# EAGLE design W5500_Tessera_mikroBUS_Click_003 (EAGLE 6.5.0)
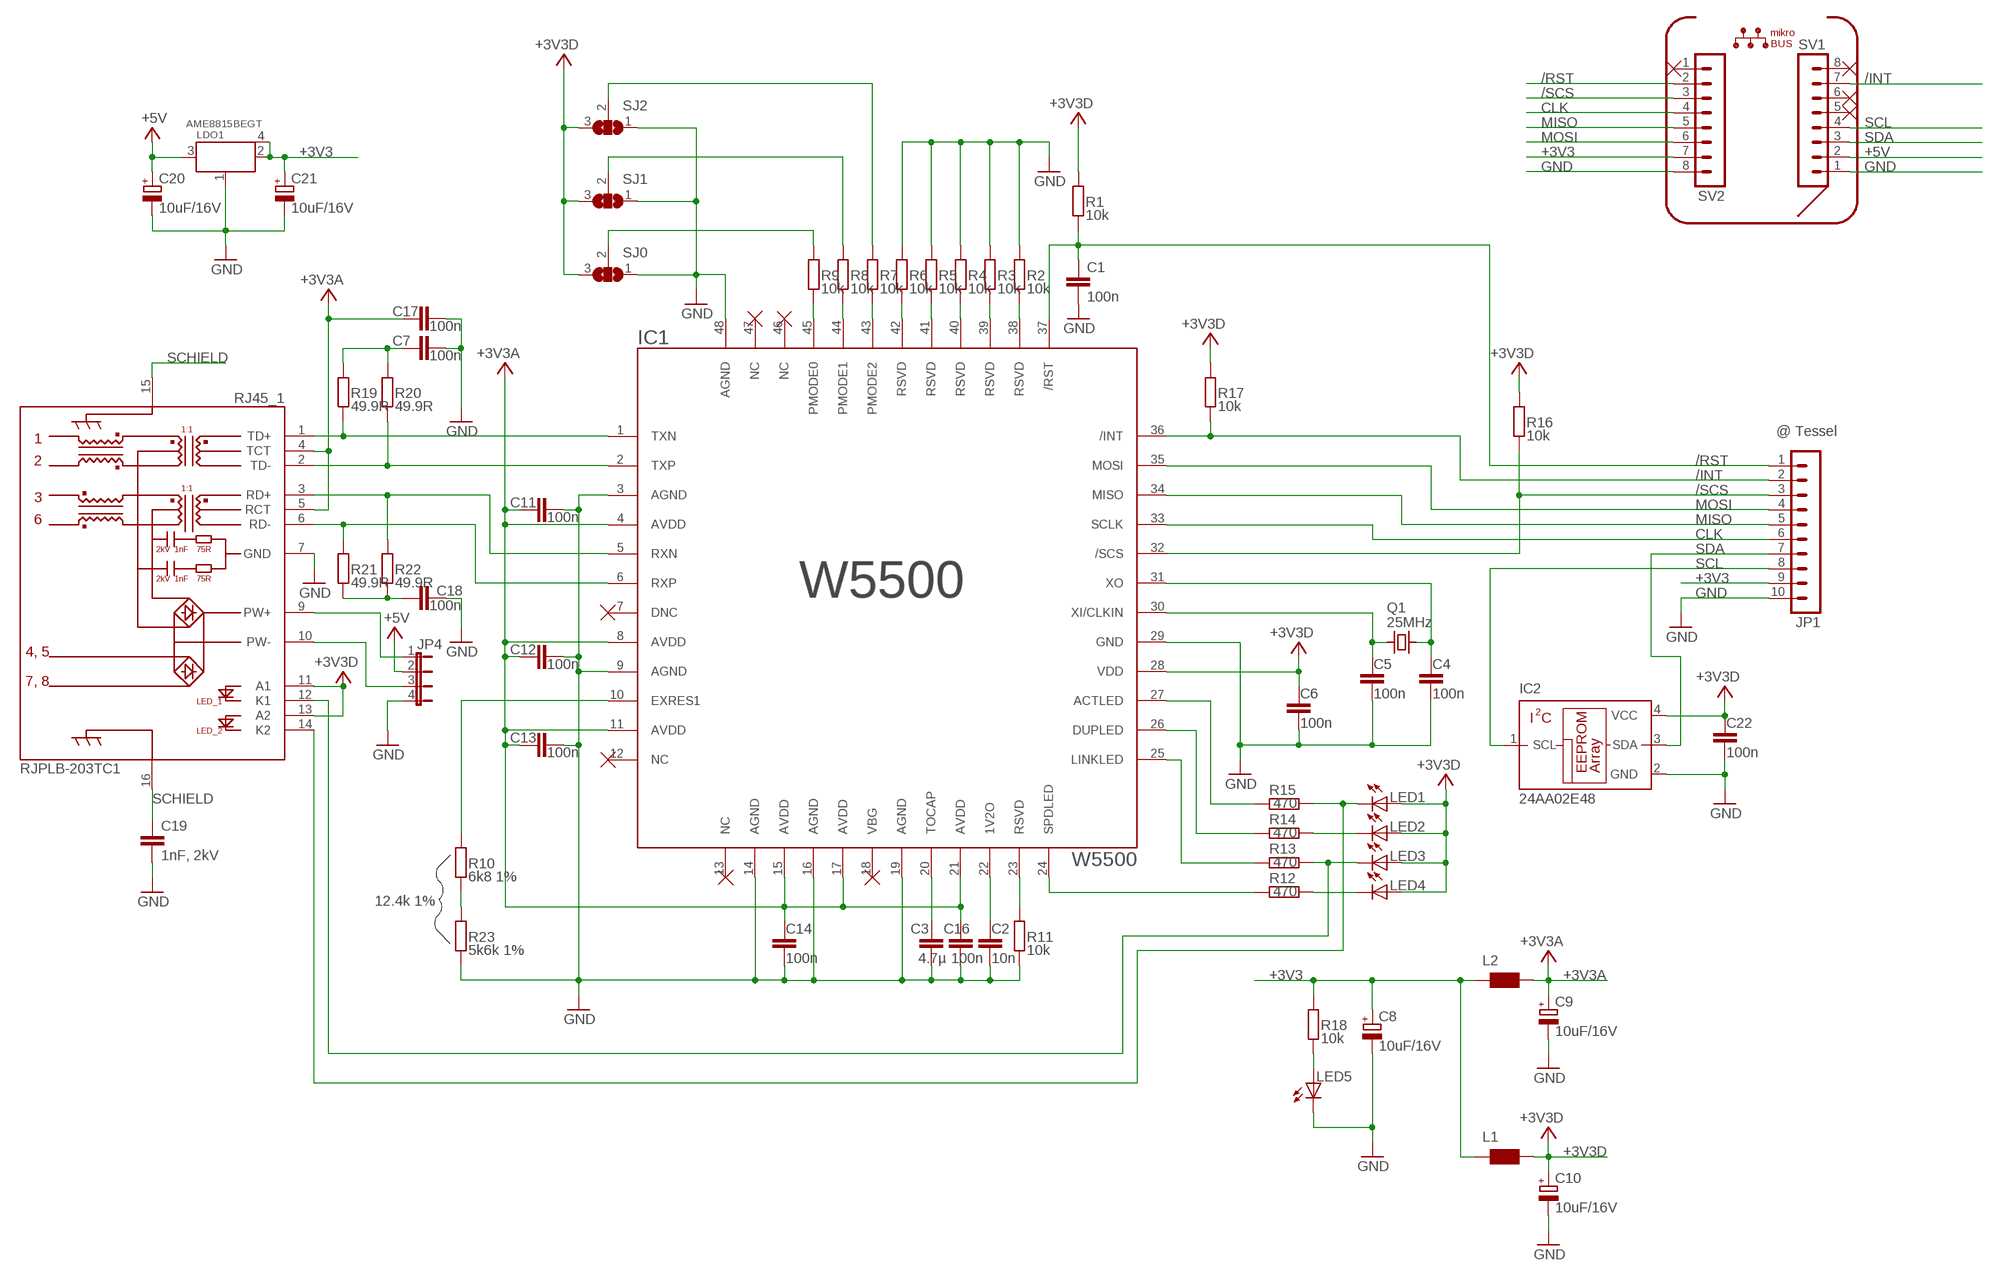
[diagram p0: schematic, sheet 1]

## Parts
C1  100n  C-EUC0603K  [C0603K]
C2  10n  C-EUC0402K  [C0402K]
C3  4.7µ  C-EUC2012  [C2012]
C4  100n  C-EUC0402K  [C0402K]
C5  100n  C-EUC0402K  [C0402K]
C6  100n  C-EUC0402K  [C0402K]
C7  100n  C-EUC0402K  [C0402K]
C8  10uF/16V  CPOL-EUA/3216-18W  [A/3216-18W]
C9  10uF/16V  CPOL-EUA/3216-18W  [A/3216-18W]
C10  10uF/16V  CPOL-EUA/3216-18W  [A/3216-18W]
C11  100n  C-EUC0402K  [C0402K]
C12  100n  C-EUC0402K  [C0402K]
C13  100n  C-EUC0402K  [C0402K]
C14  100n  C-EUC0402K  [C0402K]
C16  100n  C-EUC0402K  [C0402K]
C17  100n  C-EUC0402K  [C0402K]
C18  100n  C-EUC0402K  [C0402K]
C19  1nF, 2kV  C-EUC3216  [C3216]
C20  10uF/16V  CPOL-EUA/3216-18W  [A/3216-18W]
C21  10uF/16V  CPOL-EUA/3216-18W  [A/3216-18W]
C22  100n  C-EUC0402K  [C0402K]
IC1  W5500  [LQFP48]
IC2  24AA02E48  24AA00OT  [SOT23-5L]
JP1  @ Tessel  MA10-1  [MA10-1]
JP4  JP4E  [JP4]
L1  WE-CBF_0603  [0603]
L2  WE-CBF_0603  [0603]
LDO1  AME8815BEGT  [SOT223]
LED1  LEDCHIPLED_0603  [CHIPLED_0603]
LED2  LEDCHIPLED_0603  [CHIPLED_0603]
LED3  LEDCHIPLED_0603  [CHIPLED_0603]
LED4  LEDCHIPLED_0603  [CHIPLED_0603]
LED5  LEDCHIPLED_0603  [CHIPLED_0603]
Q1  25MHz  SMD02502-4  [SMD02502-4]
R1  10k  R-EU_R0402  [R0402]
R2  10k  R-EU_R0402  [R0402]
R3  10k  R-EU_R0402  [R0402]
R4  10k  R-EU_R0402  [R0402]
R5  10k  R-EU_R0402  [R0402]
R6  10k  R-EU_R0402  [R0402]
R7  10k  R-EU_R0402  [R0402]
R8  10k  R-EU_R0402  [R0402]
R9  10k  R-EU_R0402  [R0402]
R10  6k8 1%  R-EU_R0402  [R0402]
R11  10k  R-EU_R0402  [R0402]
R12  470  R-EU_R0402  [R0402]
R13  470  R-EU_R0402  [R0402]
R14  470  R-EU_R0402  [R0402]
R15  470  R-EU_R0402  [R0402]
R16  10k  R-EU_R0402  [R0402]
R17  10k  R-EU_R0402  [R0402]
R18  10k  R-EU_R0402  [R0402]
R19  49.9R  R-EU_R0402  [R0402]
R20  49.9R  R-EU_R0402  [R0402]
R21  49.9R  R-EU_R0402  [R0402]
R22  49.9R  R-EU_R0402  [R0402]
R23  5k6k 1%  R-EU_R0402  [R0402]
RJ45_1  RJPLB-203TC1  [RJPLB-203]
SJ0  SJ2W  [SJ_2]
SJ1  SJ2W  [SJ_2]
SJ2  SJ2W  [SJ_2]
SV1  MA08-1  [MA08-1]
SV2  MA08-1  [MA08-1]

## Nets
+3V3: C8.+ C21.+ JP1.9 JP4.2 L1.2 L2.2 LDO1.2 LDO1.4 R18.2 SV2.7 ; supply symbol labelled +5V
+3V3A: C9.+ C11.1 C12.1 C13.1 C14.1 C16.1 C17.1 IC1.4(AVDD) IC1.8(AVDD) IC1.11(AVDD) IC1.15(AVDD) IC1.17(AVDD) IC1.21(AVDD) L2.1 RJ45_1.4(TCT) RJ45_1.5(RCT)
+3V3D: C6.1 C10.+ C22.1 IC1.28(VDD) IC2.4(VCC) L1.1 LED1.A LED2.A LED3.A LED4.A R1.2 R16.2 R17.2 RJ45_1.11(A1) RJ45_1.13(A2) SJ0.3 SJ1.3 SJ2.3
+5V: C20.+ LDO1.3 SV1.2
/INT: IC1.36(/INT) JP1.2 R17.1 SV1.7
/RST: C1.1 IC1.37(/RST) JP1.1 R1.1 SV2.2
/SCS: IC1.32(/SCS) JP1.3 R16.1 SV2.3
ACTLED: IC1.27(ACTLED) R15.1
CLK: IC1.33(SCLK) JP1.6 SV2.4
GND: C1.2 C2.2 C3.2 C4.2 C5.2 C6.2 C7.2 C8.- C9.- C10.- C11.2 C12.2 C13.2 C14.2 C16.2 C17.2 C18.2 C19.2 C20.- C21.- C22.2 IC1.3(AGND) IC1.9(AGND) IC1.14(AGND) IC1.16(AGND) IC1.19(AGND) IC1.29(GND) IC1.48(AGND) IC2.2(GND) JP1.10 JP4.4 LDO1.1 LED5.C R2.2 R3.2 R4.2 R5.2 R6.2 R11.1 R23.1 RJ45_1.7(GND) SJ0.1 SJ1.1 SJ2.1 SV1.1 SV2.8
MISO: IC1.34(MISO) JP1.5 SV2.5
MOSI: IC1.35(MOSI) JP1.4 SV2.6
N$4: IC1.25(LINKLED) R13.1
N$5: R10.1 R23.2
N$9: IC1.23(RSVD) R11.2
N$10: IC1.38(RSVD) R2.1
N$11: IC1.39(RSVD) R3.1
N$12: IC1.40(RSVD) R4.1
N$13: IC1.41(RSVD) R5.1
N$14: IC1.42(RSVD) R6.1
N$15: IC1.43(PMODE2) R7.1
N$16: IC1.44(PMODE1) R8.1
N$17: IC1.45(PMODE0) R9.1
N$18: R9.2 SJ0.2
N$19: R8.2 SJ1.2
N$20: R7.2 SJ2.2
N$22: IC1.10(EXRES1) R10.2
N$23: C2.1 IC1.22(1V2O)
N$24: C3.1 IC1.20(TOCAP)
N$25: IC1.24(SPDLED) R12.1
N$26: IC1.26(DUPLED) R14.1
N$28: LED4.C R12.2
N$29: LED3.C R13.2 RJ45_1.12(K1)
N$30: LED2.C R14.2
N$31: LED1.C R15.2 RJ45_1.14(K2)
N$32: C4.1 IC1.31(XO) Q1.3
N$33: C5.1 IC1.30(XI/CLKIN) Q1.1
N$34: LED5.A R18.1
N$35: C7.1 R19.2 R20.2
N$36: C18.1 R21.1 R22.1
POE+: JP4.1 RJ45_1.9(PW+)
POE-: JP4.3 RJ45_1.10(PW-)
RXN: IC1.6(RXP) R21.2 RJ45_1.6(RD-)
RXP: IC1.5(RXN) R22.2 RJ45_1.3(RD+)
SCHIELD: C19.1 RJ45_1.15(SCHIELD_1) RJ45_1.16(SCHIELD_2)
SCL: IC2.1(SCL) JP1.8 SV1.4
SDA: IC2.3(SDA) JP1.7 SV1.3
TXN: IC1.2(TXP) R20.1 RJ45_1.2(TD-)
TXP: IC1.1(TXN) R19.1 RJ45_1.1(TD+)
Unconnected: IC1.7(DNC) IC1.12(NC) IC1.13(NC) IC1.18(VBG) IC1.46(NC) IC1.47(NC) SV1.5 SV1.6 SV1.8 SV2.1

## Notes on the sheet
- mikro
  BUS
- W5500
- 12.4k 1%

## Library data of the parts
C1-C7 C11-C14 C16-C19 C22 = resistor:C-EU: CAPACITOR, European symbol
C8-C10 C20 C21 = resistor:CPOL-EU: POLARIZED CAPACITOR, European symbol
IC1 = _wiznet_2013-08-18:W5500: W5500: WIZnet Hardwired TCP/IP + MAC + PHY - Internet Interface Chip
IC2 = microchip:24*00: Serial EEPROM 128 bit, I2C (AA = 1.8 V/LC = 2.5 V/C = 5.0 V); MF: MICROCHIP; MPN: 24AA00T-I/OTG; OC_FARNELL: 1331264; OC_NEWARK: 89H3038
JP1 = con-lstb:MA10-1: PIN HEADER; OC_FARNELL: unknown; OC_NEWARK: unknown
JP4 = jumper:JP4E: JUMPER
L1 L2 = wuerth-elektronik:WE-CBF: SMD EMI Suppression Ferrite Beads - excellent anti-EMI properties - low DCR - impedances till 3000 ohms - rated current up to 6 A
LDO1 = _wiznet_2013-08-18:AME8815BEGT
LED1-LED5 = led:LED: LED OSRAM: - CHIPLED LG R971, LG N971, LY N971, LG Q971, LY Q971, LO R971, LY R971 LH N974, LH R974 LS Q976, LO Q976, LY Q976 LO Q996 - Hyper CHIPLED LW Q18S LB Q993, LB Q99A, LB R99A - SideLED LS A670, LO A670, LY A670, LG A670, LP A670 LB A673, LV A673, LT A673, LW A673 LH A674 LY A675 LS A676, LA A676, LO A676, LY A676, LW A676 LS A679, LY A679, LG A679 - Hyper Micro SIDELED® LS Y876, LA Y876, LO Y876, LY Y876 LT Y87S - SmartLED LW L88C, LW L88S LB L89C, LB L89S, LG L890 LS L89K, LO L89K, LY L89K LS L896, LA L896, LO L896, LY L896 - TOPLED LS T670, LO T670, LY T670, LG T670, LP T670 LSG T670, LSP T670, LSY T670, LOP T670, LYG T670 LG T671, LOG T671, LSG T671 LB T673, LV T673, LT T673, LW T673 LH T674 LS T676, LA T676, LO T676, LY T676, LB T676, LH T676, LSB T676, LW T676 LB T67C, LV T67C, LT T67C, LS T67K, LO T67K, LY T67K, LW E67C LS E67B, LA E67B, LO E67B, LY E67B, LB E67C, LV E67C, LT E67C LW T67C LS T679, LY T679, LG T679 LS T770, LO T770, LY T770, LG T770, LP T770 LB T773, LV T773, LT T773, LW T773 LH T774 LS E675, LA E675, LY E675, LS T675 LS T776, LA T776, LO T776, LY T776, LB T776 LHGB T686 LT T68C, LB T68C - Hyper Mini TOPLED® LB M676 - Mini TOPLED Santana® LG M470 LS M47K, LO M47K, LY M47K Source: http://www.osram.convergy.de LUXEON: - LUMILED® LXK2-PW12-R00, LXK2-PW12-S00, LXK2-PW14-U00, LXK2-PW14-V00 LXK2-PM12-R00, LXK2-PM12-S00, LXK2-PM14-U00 LXK2-PE12-Q00, LXK2-PE12-R00, LXK2-PE12-S00, LXK2-PE14-T00, LXK2-PE14-U00 LXK2-PB12-K00, LXK2-PB12-L00, LXK2-PB12-M00, LXK2-PB14-N00, LXK2-PB14-P00, LXK2-PB14-Q00 LXK2-PR12-L00, LXK2-PR12-M00, LXK2-PR14-Q00, LXK2-PR14-R00 LXK2-PD12-Q00, LXK2-PD12-R00, LXK2-PD12-S00 LXK2-PH12-R00, LXK2-PH12-S00 LXK2-PL12-P00, LXK2-PL12-Q00, LXK2-PL12-R00 Source: www.luxeon.com KINGBRIGHT: KA-3528ASYC Source: www.kingbright.com
Q1 = Petermann_5_11_0:SMD02502-4
R1-R23 = resistor:R-EU_: RESISTOR, European symbol
RJ45_1 = Taimag:RJPLB-203TC1
SJ0 SJ1 SJ2 = jumper:SJ2W: SMD solder JUMPER
SV1 SV2 = con-lstb:MA08-1: PIN HEADER; OC_FARNELL: unknown; OC_NEWARK: unknown

## Board
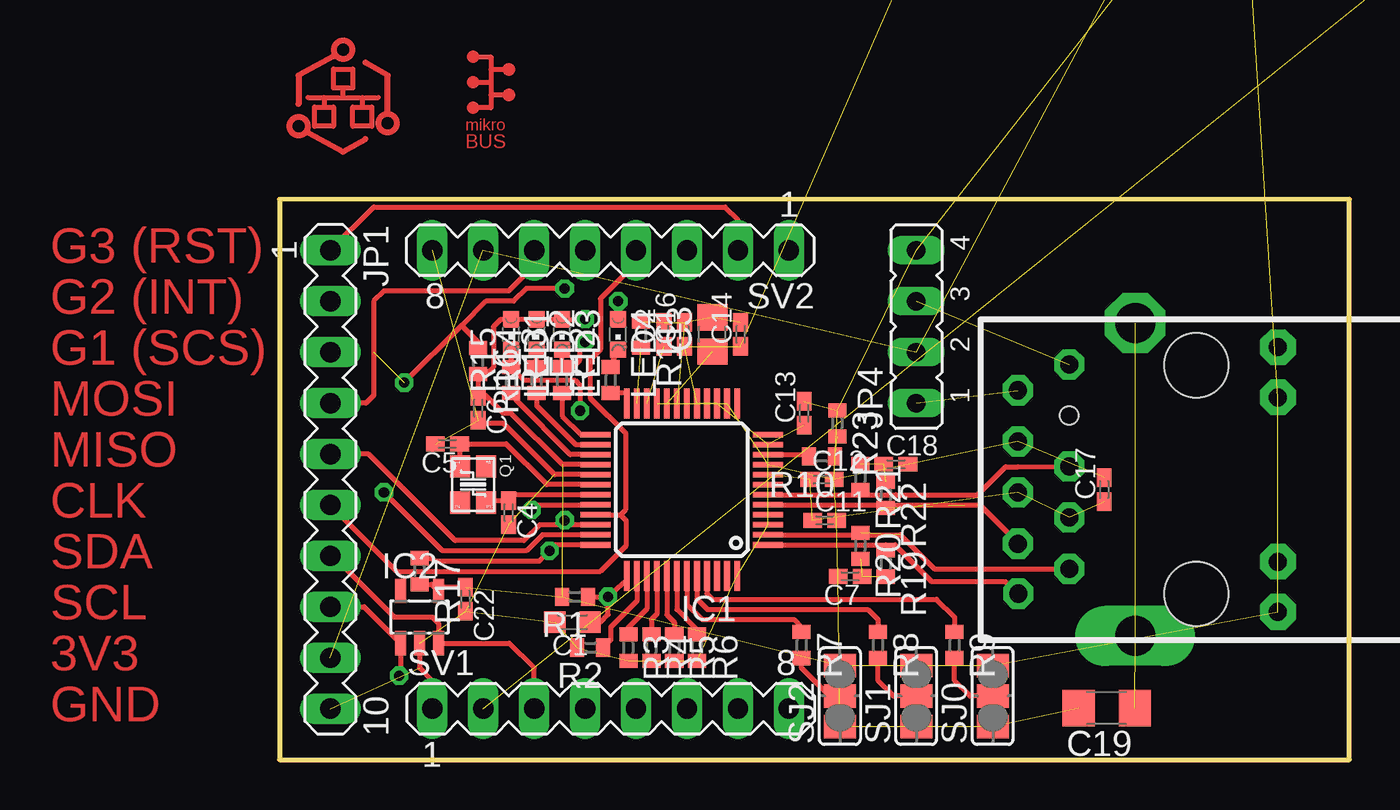
[diagram p1: board, top side]
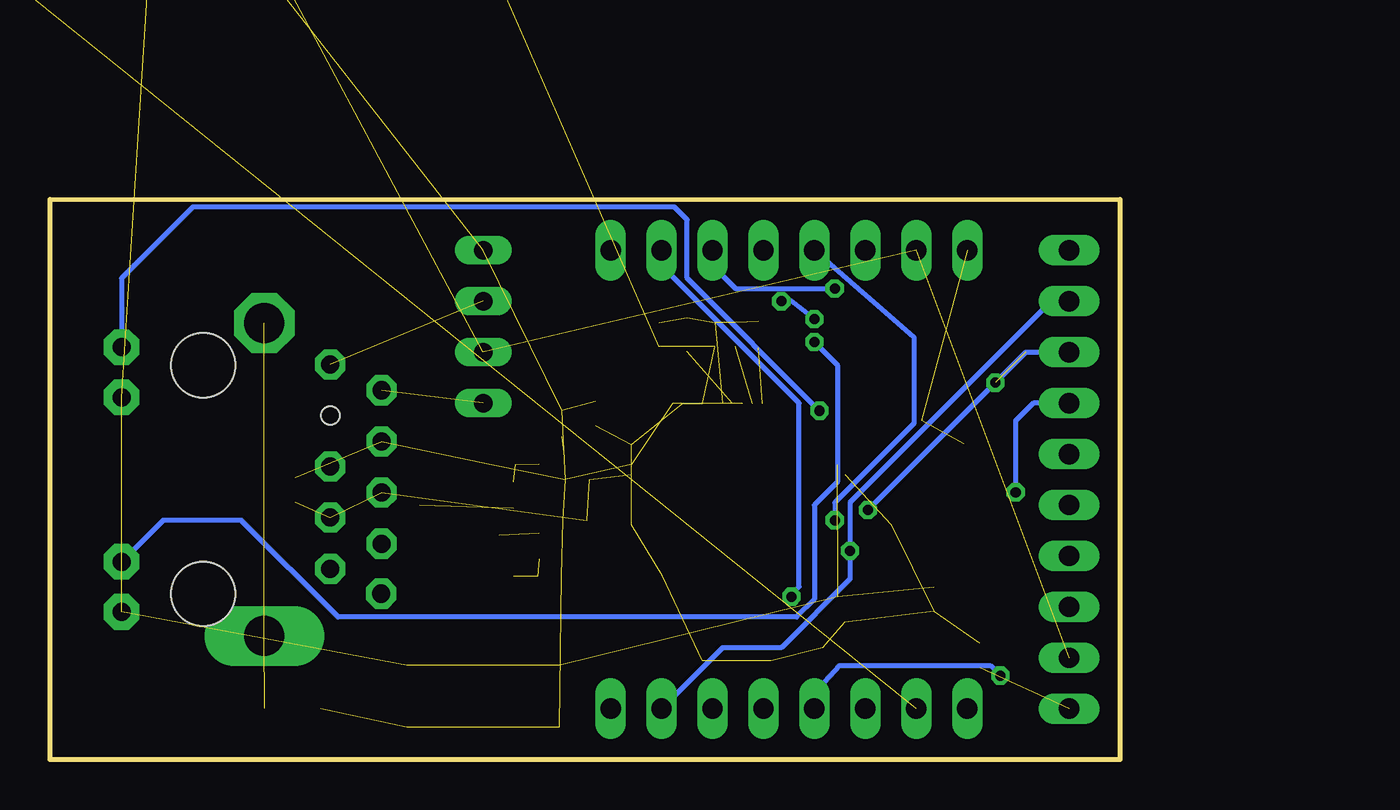
[diagram p2: board, bottom side, seen from below]

Size 53.34 x 27.94 mm. Coordinates in mm from the lower left corner, seen from the top.
Outline: 0,0 53.34,0 53.34,27.94 0,27.93 0,0
Copper layers (1*16): Top 0.035mm / dielectric 1.5mm / Bottom 0.035mm
Design rules "default": minimum track width 10mil, minimum drill 24mil, track to track 8mil, track to pad 8mil, pad to pad 8mil, via to via 8mil, smd to smd 8mil, copper to edge 40mil, drill to drill 8mil, minimum pad ring 10mil, minimum via ring 8mil, stop-mask expansion 4mil, vias tented up to drill 0mil, thermal gap 10mil

### Footprints (pad centres in the part's own frame; a part is rotated, then mirrored left to right if it is on the bottom)
C0603K = smd 1.05 x 1.08: 1 -0.875,0; 2 0.875,0
C0402K = smd 0.925 x 0.74: 1 -0.6,0; 2 0.6,0
C2012 = smd 1.3 x 1.5: 1 -0.85,0; 2 0.85,0
A/3216-18W = smd 2.15 x 1.8: + 1.475,0; - -1.475,0
C3216 = smd 1.6 x 1.8: 1 -1.4,0; 2 1.4,0
LQFP48 = smd 1.5 x 0.28: 1 -4.3,2.75; 2 -4.3,2.25; 3 -4.3,1.75; 4 -4.3,1.25; 5 -4.3,0.75; 6 -4.3,0.25; 7 -4.3,-0.25; 8 -4.3,-0.75; 9 -4.3,-1.25; 10 -4.3,-1.75; 11 -4.3,-2.25; 12 -4.3,-2.75; 25 4.3,-2.75; 26 4.3,-2.25; 27 4.3,-1.75; 28 4.3,-1.25; 29 4.3,-0.75; 30 4.3,-0.25; 31 4.3,0.25; 32 4.3,0.75; 33 4.3,1.25; 34 4.3,1.75; 35 4.3,2.25; 36 4.3,2.75 | smd 0.28 x 1.5: 13 -2.75,-4.3; 14 -2.25,-4.3; 15 -1.75,-4.3; 16 -1.25,-4.3; 17 -0.75,-4.3; 18 -0.25,-4.3; 19 0.25,-4.3; 20 0.75,-4.3; 21 1.25,-4.3; 22 1.75,-4.3; 23 2.25,-4.3; 24 2.75,-4.3; 37 2.75,4.3; 38 2.25,4.3; 39 1.75,4.3; 40 1.25,4.3; 41 0.75,4.3; 42 0.25,4.3; 43 -0.25,4.3; 44 -0.75,4.3; 45 -1.25,4.3; 46 -1.75,4.3; 47 -2.25,4.3; 48 -2.75,4.3
SOT23-5L = smd 0.55 x 1.2: 1 -0.95,-1.3; 2 0,-1.3; 3 0.95,-1.3; 4 0.95,1.3; 5 -0.95,1.3
MA10-1 = drill 1.016 long: 1 -11.43,0; 2 -8.89,0; 3 -6.35,0; 4 -3.81,0; 5 -1.27,0; 6 1.27,0; 7 3.81,0; 8 6.35,0; 9 8.89,0; 10 11.43,0
JP4 = drill 0.914 long: 1 -3.81,0; 2 -1.27,0; 3 1.27,0; 4 3.81,0
0603 = smd 0.85 x 0.7: 1 -0.9,0; 2 0.7,0
SOT223 = smd 1.499 x 2.007: 1 -2.261,-3.15; 2 0.025,-3.15; 3 2.311,-3.15 | smd 3.81 x 2.007: 4 0,3.15
CHIPLED_0603 = smd 0.8 x 0.8: A 0,-0.75; C 0,0.75
SMD02502-4 = smd 1.1 x 1: 1 -0.9,-0.65; 2 0.9,-0.65; 3 0.9,0.65; 4 -0.9,0.65
R0402 = smd 0.7 x 0.9: 1 -0.65,0; 2 0.65,0
RJPLB-203 = drill 0.9 pad 1.5 octagon: 1 -5.69,8.888; 2 -4.45,6.348; 3 -3.2,8.898; 4 -1.9,6.348; 5 -0.65,8.898; 6 0.65,6.348; 7 1.9,8.898; 9 4.45,8.898; 10 5.74,6.348 | drill 0.9 pad 1.778 octagon: 11 -6.6,-4.062; 12 -4.1,-4.062; 13 4.1,-4.062; 14 6.6,-4.062 | drill 2 pad 2.2 long: 15 -7.8,3.058 | drill 2 pad 3 octagon: 16 7.8,3.058 | hole 3.2: 5.7,0.008; -5.7,0.008 | hole 0.9: 3.2,6.35
SJ_2 = smd 1.168 x 1.6: 1 -1.524,0; 2 0,0; 3 1.524,0
MA08-1 = drill 1.016 long: 1 -8.89,0; 2 -6.35,0; 3 -3.81,0; 4 -1.27,0; 5 1.27,0; 6 3.81,0; 7 6.35,0; 8 8.89,0

### Placement (x,y rotation side)
C1  14.61,6.86 180 top
C2  19.18,21.21 90 top
C3  21.59,21.21 90 top
C4  11.43,12.32 270 top
C5  8.38,15.75 180 top
C6  9.91,17.53 270 top
C7  28.45,9.14 180 top
C8  45.28,44.2 90 top  (outside the outline)
C9  39.12,51.94 90 top  (outside the outline)
C10  47.5,52.32 90 top  (outside the outline)
C11  27.18,11.94 0 top
C12  27.05,13.97 0 top
C13  26.16,17.27 90 top
C14  22.99,21.21 90 top
C16  20.19,21.21 90 top
C17  41.12,13.46 90 top
C18  30.73,14.73 0 top
C19  41.24,2.57 180 top
C20  60.33,42.55 270 bottom  (outside the outline)
C21  55.88,48.26 0 bottom  (outside the outline)
C22  9.27,8 270 top
IC1  20.07,13.46 180 top
IC2  6.99,7.11 0 top
JP1  2.54,13.97 270 top
JP4  31.75,21.59 90 top
L1  44.7,54.48 180 top  (outside the outline)
L2  36.7,54.1 180 top  (outside the outline)
LDO1  54.61,43.18 270 bottom  (outside the outline)
LED1  11.56,21.21 180 top
LED2  12.83,21.21 180 top
LED3  14.1,21.21 180 top
LED4  16.89,21.21 180 top
LED5  47.18,43.43 180 top  (outside the outline)
Q1  9.65,13.72 270 top
R1  14.73,8.13 180 top
R2  15.49,5.59 180 top
R3  17.4,5.59 270 top
R4  18.54,5.59 270 top
R5  19.68,5.59 270 top
R6  20.83,5.59 270 top
R7  26.04,5.71 270 top
R8  29.84,5.71 270 top
R9  33.66,5.71 270 top
R10  27.05,15.11 180 top
R11  18.03,21.21 270 top
R12  16.51,18.92 90 top
R13  14.1,18.92 90 top
R14  12.83,18.92 90 top
R15  11.56,18.92 90 top
R16  9.91,19.88 270 top
R17  6.99,9.4 270 top
R18  47.18,45.85 90 top  (outside the outline)
R19  30.23,9.78 270 top
R20  28.96,10.67 270 top
R21  28.96,14.1 270 top
R22  30.23,13.21 270 top
R23  27.81,16.76 270 top
RJ45_1  45.72,13.97 90 top
SJ0  35.56,3.17 90 top
SJ1  31.75,3.17 90 top
SJ2  27.94,3.17 90 top
SV1  16.51,2.54 0 top
SV2  16.51,25.4 180 top

### Tracks (layer width: path | path; a pad name or v marks a point on that pad's centre or on a via)
+3V3  (9 unrouted)
+3V3A  (15 unrouted)
+3V3D  (via drill 0.5 pad 0.25)  (9 unrouted)
  Top 0.254: C22.1 8.12,8.6 IC2.4 7.6,8.75 R17.2 | IC1.28 14.12,14.71 11.56,17.27 11.18,17.27 10.29,18.16 9.94,18.16 C6.1 R16.2 10.34,19.23 10.67,19.56 10.67,21.59 11.04,21.96 LED1.A LED2.A LED3.A 14.85,21.96 v15.24,21.97 | v16.89,22.86 LED4.A
  Bottom 0.254: v15.24,21.97 16.38,22.86 v16.89,22.86
+5V  (2 unrouted)
/INT  (via drill 0.5 pad 0.25)
  Top 0.254: IC1.36 13.76,10.71 v13.46,10.41 12.95,9.91 7.75,9.91 7.61,10.05 R17.1
  Bottom 0.254: SV1.7 19.81,5.59 16.89,5.59 13.46,9.02 v13.46,10.41 13.46,12.83 3.43,22.86 JP1.2
/RST  (via drill 0.5 pad 0.25)
  Top 0.254: JP1.1 4.7,27.56 22.23,27.56 22.86,26.92 SV2.2 | IC1.37 17.32,8.93 v16.38,8.13 | C1.1 16,6.86 16.38,7.24 v16.38,8.13 | R1.1 v16.38,8.13
  Bottom 0.254: v16.38,8.13 16,8.64 16,17.78 22.86,24.64 SV2.2
/SCS  (via drill 0.5 pad 0.25)  (1 unrouted)
  Top 0.254: v12.57,12.45 12.84,12.71 IC1.32 | v14.22,23.5 12.32,23.5 11.68,22.86 10.29,22.86 9.08,21.65 | 9.08,21.65 v6.22,18.8 | R16.1 9.91,20.83 9.08,21.65
  Bottom 0.254: SV2.3 20.32,24.64 19.18,23.5 v14.22,23.5 | v12.57,12.45 4.7,20.32 JP1.3
ACTLED
  Top 0.254: IC1.27 14.49,15.21 11.81,17.91 11.54,18.16 R15.1
CLK
  Top 0.254: IC1.33 17,12.21 | 17,12.21 17.27,11.94 17.27,10.67 16,9.4 5.84,9.4 JP1.6 | 17,12.21 17.27,12.49 17.27,16.26 15.49,18.03 15.49,19.94 16,20.45 16,22.99 17.78,24.77 SV2.4
GND  (43 unrouted)
  Top 0.254: IC2.2 6.99,4.57 7.62,3.94 SV1.1 | IC1.29 13.73,14.21 11.18,16.76 10.07,16.76 C6.2
MISO  (via drill 0.5 pad 0.25)
  Top 0.254: 14,11.71 13.97,11.71 | 13.97,11.71 12.98,11.71 12.19,10.92 8.76,10.92 4.45,15.24 JP1.5 | IC1.34 14.45,11.71 v14.22,11.94 13.97,11.71
  Bottom 0.254: v14.22,11.94 14.22,12.83 10.29,16.76 10.29,21.08 SV2.5
MOSI  (via drill 0.5 pad 0.25)
  Top 0.254: IC1.35 13.12,11.21 12.32,10.41 8.13,10.41 v5.21,13.34 | SV2.6 12.7,24.64 11.43,23.37 5.21,23.37 4.7,22.86 4.7,18.16 4.32,17.78 JP1.4
  Bottom 0.254: JP1.4 4.32,17.78 5.21,16.89 v5.21,13.34
N$1
  Top 0.305: 2.7,35.08 0.95,34.12 0.95,32.7
N$2
  Top 0.305: 1.43,31.27 3.17,30.32 4.29,30.95
N$3
  Top 0.305: 5.4,32.22 5.4,34.12 4.29,34.76
N$4
  Top 0.254: R13.1 14.1,17.14 15.03,16.21 IC1.25
N$5  (1 unrouted)
N$6
  Top 0.254: 9.65,35.05 10.54,35.05 10.54,34.42 | 11.43,34.42 10.54,34.42 | 10.54,34.42 10.54,33.78 | 9.65,33.78 10.54,33.78 | 10.54,33.78 10.54,33.15 | 11.43,33.15 10.54,33.15 | 10.54,33.15 10.54,32.51 9.65,32.51
N$8
  Top 0.254: 1.43,33.01 2.22,33.01 | 2.22,33.01 3.17,33.01 | 3.17,33.01 4.13,33.01 | 4.13,33.01 4.92,33.01 | 3.17,33.01 3.17,33.49 | 3.17,33.49 2.7,33.49 2.7,34.44 3.65,34.44 3.65,33.49 3.17,33.49 | 4.13,33.01 4.13,32.54 | 4.13,32.54 4.6,32.54 4.6,31.59 3.65,31.59 3.65,32.54 4.13,32.54 | 2.22,33.01 2.22,32.54 | 2.22,32.54 2.7,32.54 2.7,31.59 1.75,31.59 1.75,32.54 2.22,32.54
N$9  (1 unrouted)
N$10
  Top 0.254: IC1.38 17.82,7.91 16.51,6.6 16.51,5.97 16.14,5.6 R2.1
N$11
  Top 0.254: IC1.39 18.32,7.52 17.4,6.6 R3.1
N$12
  Top 0.254: IC1.40 18.82,7.26 18.54,6.99 R4.1
N$13
  Top 0.254: IC1.41 19.32,7.23 19.68,6.86 R5.1
N$14
  Top 0.254: IC1.42 19.82,7.49 20.83,6.48 R6.1
N$15
  Top 0.254: IC1.43 20.32,7.75 21.08,6.99 25.65,6.99 26.04,6.6 R7.1
N$16
  Top 0.254: IC1.44 20.82,8.01 21.34,7.49 29.34,7.49 29.84,6.99 R8.1
N$17
  Top 0.254: IC1.45 21.32,8.28 21.59,8 32.77,8 33.66,7.11 R9.1
N$18
  Top 0.254: SJ0.2 34.42,3.17 33.66,3.94 R9.2
N$19
  Top 0.254: SJ1.2 30.61,3.17 29.84,3.94 R8.2
N$20
  Top 0.254: SJ2.2 27.43,3.17 26.04,4.57 R7.2
N$22
  Top 0.254: IC1.10 26.3,15.21 R10.2
N$23  (1 unrouted)
N$24  (1 unrouted)
N$25
  Top 0.254: IC1.24 17.32,18.27 R12.1
N$26
  Top 0.254: R14.1 12.83,17.65 14.77,15.71 IC1.26
N$28
  Top 0.254: R12.2 LED4.C
N$29  (via drill 0.5 pad 0.25)
  Top 0.254: LED3.C R13.2 14.1,19.56 14.61,19.56 14.99,19.94 14.99,20.57 v15.24,20.83
  Bottom 0.254: v15.24,20.83 14.1,19.68 14.1,13.84 15.24,12.7 15.24,8 16.13,7.11 38.99,7.11 43.81,11.94 47.71,11.94 RJ45_1.12
N$30
  Top 0.254: R14.2 LED2.C
N$31  (via drill 0.5 pad 0.25)
  Top 0.254: R15.2 LED1.C 11.56,19.56 12.19,18.92 14.73,18.92 14.99,18.67 v14.99,17.4
  Bottom 0.254: v14.99,17.4 21.59,24 21.59,26.92 22.23,27.56 46.23,27.56 49.78,24 RJ45_1.14
N$32
  Top 0.254: IC1.31 15.75,13.21 13.97,13.21 11.65,13.21 C4.1 10.53,12.92 Q1.3
N$33
  Top 0.254: IC1.30 13.34,13.71 11.3,15.75 C5.1 9,15.73 Q1.1
N$34  (1 unrouted)
N$35  (2 unrouted)
N$36  (2 unrouted)
POE+  (1 unrouted)
POE-  (1 unrouted)
RXN
  Top 0.254: IC1.6 30.35,13.21 | 30.35,13.21 30.73,13.21 34.8,13.21 36.2,14.61 36.82,14.61 RJ45_1.6 | R21.2 28.96,13.21 30.35,13.21
RXP  (1 unrouted)
  Top 0.254: IC1.5 34.91,12.71 36.85,10.77 RJ45_1.3
SCHIELD  (2 unrouted)
SCL  (via drill 0.5 pad 0.25)
  Top 0.254: JP1.8 4.23,7.62 IC2.1 6.04,4.26 v5.97,4.19
  Bottom 0.254: SV1.4 15.24,3.3 13.97,4.7 6.48,4.7 v5.97,4.19
SDA
  Top 0.254: JP1.7 2.67,10.16 5.71,7.11 7.62,7.11 7.93,6.8 IC2.3 11.46,5.81 12.7,4.57 SV1.3
TXN  (1 unrouted)
  Top 0.254: IC1.2 30.95,11.21 32.64,9.52 RJ45_1.2
TXP
  Top 0.254: IC1.1 30.23,10.71 | 30.23,10.71 30.69,10.71 32.51,8.89 36.2,8.89 36.8,8.28 RJ45_1.1 | R19.1 30.23,10.71
(copper drawn outside any net)
  shapes: Top circle x8

### Text on the board
Top: W5500 - Tessel Module, see: http://www.technical.io/ | W5500 - Espruino Module, see: http://www.espruino.com/ | W5500 - mikroBUS(TM) Module, see: http://www.mikroe.com | mikro | BUS | G3 (RST) | G2 (INT) | G1 (SCS) | MOSI | MISO | CLK | SDA | SCL | 3V3 | GND
Document: PoE out | GND | GPIOs | Ethernet / + PoE | PoE- | +5V | PoE+ | SPI | I²C | Power